# EasyEDA schematic board-rev1-schematic.json
TITLE: BE6502; REV: 3; Date: 2021-04-18; Sheet: 1/1; Drawn By: schlachet; Company: schlachet
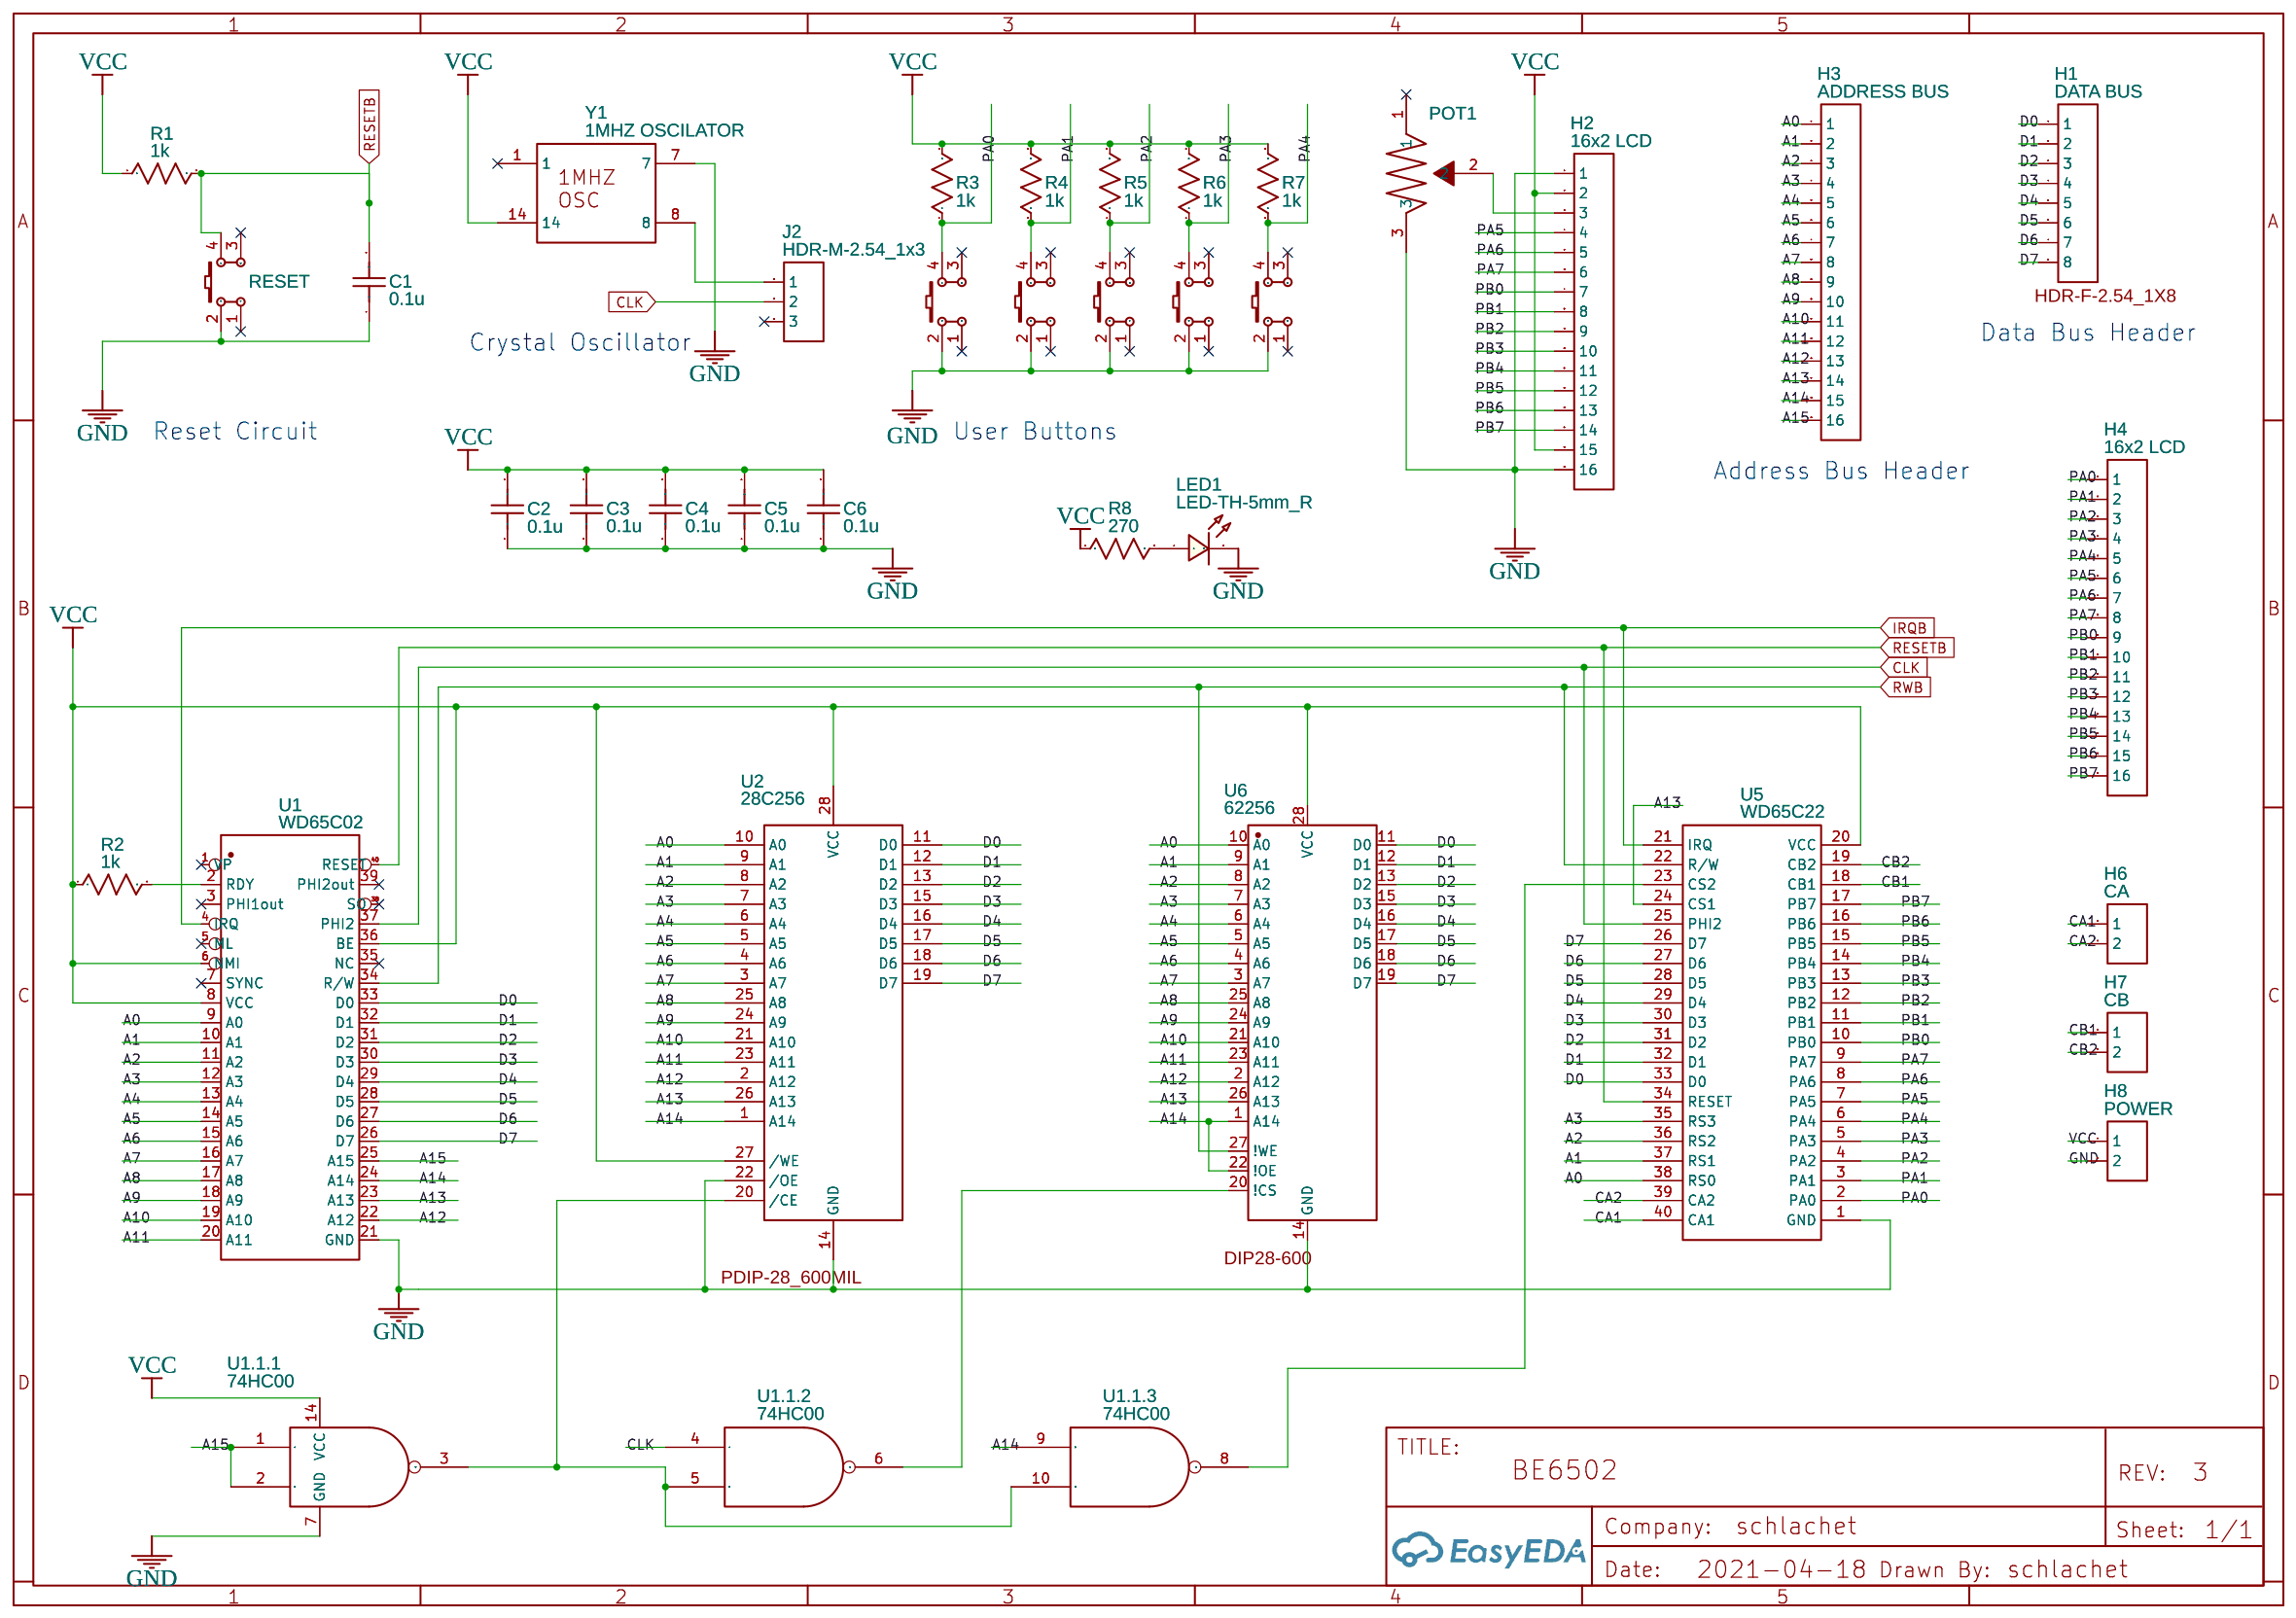
[diagram p0: schematic sheet]

## Parts
C1  0.1u  [RAD-0.1]
C2  0.1u  [RAD-0.1]
C3  0.1u  [RAD-0.1]
C4  0.1u  [RAD-0.1]
C5  0.1u  [RAD-0.1]
C6  0.1u  [RAD-0.1]
H1  DATA BUS  [HDR-F-2.54_1X8]
H2  16x2 LCD  [HDR-F-2.54_1X16]
H3  ADDRESS BUS  [HDR-F-2.54_1X16]
H4  16x2 LCD  [HDR-F-2.54_1X16]
H6  CA  [HDR-F-2.54_1X2]
H7  CB  [HDR-F-2.54_1X2]
H8  POWER  [HDR-F-2.54_1X2]
J2  HDR-M-2.54_1x3  [HDR-M-2.54_1X3]
KEY2  K4-6×6_TH  [KEY-TH_4P-L6.0-W6.0-P4.50-LS6.5]
KEY3  K4-6×6_TH  [KEY-TH_4P-L6.0-W6.0-P4.50-LS6.5]
KEY4  K4-6×6_TH  [KEY-TH_4P-L6.0-W6.0-P4.50-LS6.5]
KEY5  K4-6×6_TH  [KEY-TH_4P-L6.0-W6.0-P4.50-LS6.5]
KEY6  K4-6×6_TH  [KEY-TH_4P-L6.0-W6.0-P4.50-LS6.5]
LED1  LED-TH-5mm_R  [LED-TH_BD5.0_RED]
POT1  3352 - 3/8 ˝ Round Trimpot Trimming Potentiometer  [3352 - 3/8 ˝ ROUND TRIMPOT TRIMMING POTENTIOMETER]
R1  1k  [R_AXIAL-0.3]
R2  1k  [R_AXIAL-0.3]
R3  1k  [R_AXIAL-0.3]
R4  1k  [R_AXIAL-0.3]
R5  1k  [R_AXIAL-0.3]
R6  1k  [R_AXIAL-0.3]
R7  1k  [R_AXIAL-0.3]
R8  270  [R_AXIAL-0.3]
RESET  K4-6×6_TH  [KEY-TH_4P-L6.0-W6.0-P4.50-LS6.5]
U1  WD65C02  [DIP-40_L52.3-W13.9-P2.54-LS15.2-BL]
U1.1  74HC00  [DIP-14_L19.0-W7.0-P2.54-LS7.6-BL]  (sections 1,2,3)
U2  28C256  [PDIP-28_600MIL]
U5  WD65C22  [DIP-40_L52.0-W13.7-P2.54-LS15.2-BL]
U6  62256  [DIP28-600]
Y1  1MHZ OSCILATOR  [1 MHZ OSC]

## Library data of the parts
C1-C6 = C_RAD-0.1_US: Contributor: LCEDA_Lib
H1 = HDR-F-2.54_1x8: Supplier Part: C225505; Supplier: LCSC; Contributor: LCEDA_Lib; Package Display: Yes
H2-H4 = HDR-F-2.54_1x16: Supplier Part: C66987; Supplier: LCSC; Contributor: LCEDA_Lib
H6-H8 = HDR-F-2.54_1x2: Supplier Part: C49661; Supplier: LCSC; Contributor: LCEDA_Lib
J2 = HDR-M-2.54_1x3: Supplier Part: C180248; Supplier: LCSC; Contributor: LCEDA_Lib
KEY2-KEY6 RESET = K4-6×6_TH: Supplier: LCSC; Supplier Part: C136684; Manufacturer: 韩国韩荣; Manufacturer Part: K2-1102DP-E4SW-04; Contributor: LCEDA_Lib
LED1 = LED-TH-5mm_R: Manufacturer: EVERLIGHT(台湾亿光); Manufacturer Part: 333-2SURD/S530-A3; Supplier Part: C87271; Supplier: LCSC; Contributor: LCEDA_Lib
POT1 = 3352 - 3/8 ˝ Round Trimpot Trimming Potentiometer: Manufacturer: Bourns Inc.; Manufacturer Part: 3352T-1-103LF; Supplier: Digi-Key; Supplier Part: 3352T-103LF-ND; link: https://www.digikey.ca/en/products/detail/bourns-inc/3352T-1-103LF/1088341; Contributor: pilotstev
R1-R8 = R_AXIAL-0.3_US: Contributor: LCEDA_Lib
U1 = WD65C02: link: https://eater.net/datasheets/w65c02s.pdf; Contributor: BBMBB
U1.1 = 74HC00: Contributor: i.kamsai; subpart_no: 1
U2 = 28C256: Manufacturer: Catalyst Semiconductor; Manufacturer Part: CAT28C256; Contributor: marek999.1999; Package Display: Yes
U5 = WD65C22: Contributor: 21schemerhornn
U6 = 62256: Supplier: Digi-Key; Contributor: Havachi; Package Display: Yes
Y1 = 1MHZ OSCILATOR: Contributor: wpratt

## Nets
GND: C1.1 C2.1 C3.1 C4.1 C5.1 C6.1 H2.1 H2.16 H8.2 KEY2.2 KEY3.2 KEY4.2 KEY5.2 KEY6.2 LED1.2 POT1.3 RESET.2 U1.21(GND) U1.1.7(GND) U2.14(GND) U2.22(/OE) U5.1(GND) U6.14(GND) Y1.7
VCC: C2.2 C3.2 C4.2 C5.2 C6.2 H2.2 H2.15 H8.1 R1.1 R2.1 R3.2 R4.2 R5.2 R6.2 R7.2 R8.1 U1.6(NMI) U1.8(VCC) U1.36(BE) U1.1.14(VCC) U2.27(/WE) U2.28(VCC) U5.20(VCC) U6.28(VCC) Y1.14
A0: H3.1 U1.9(A0) U2.10(A0) U5.38(RS0) U6.10(A0)
A1: H3.2 U1.10(A1) U2.9(A1) U5.37(RS1) U6.9(A1)
A2: H3.3 U1.11(A2) U2.8(A2) U5.36(RS2) U6.8(A2)
A3: H3.4 U1.12(A3) U2.7(A3) U5.35(RS3) U6.7(A3)
A4: H3.5 U1.13(A4) U2.6(A4) U6.6(A4)
A5: H3.6 U1.14(A5) U2.5(A5) U6.5(A5)
A6: H3.7 U1.15(A6) U2.4(A6) U6.4(A6)
A7: H3.8 U1.16(A7) U2.3(A7) U6.3(A7)
A8: H3.9 U1.17(A8) U2.25(A8) U6.25(A8)
A9: H3.10 U1.18(A9) U2.24(A9) U6.24(A9)
A10: H3.11 U1.19(A10) U2.21(A10) U6.21(A10)
A11: H3.12 U1.20(A11) U2.23(A11) U6.23(A11)
A12: H3.13 U1.22(A12) U2.2(A12) U6.2(A12)
A13: H3.14 U1.23(A13) U2.26(A13) U5.24(CS1) U6.26(A13)
A14: H3.15 U1.24(A14) U1.1.9 U2.1(A14) U6.1(A14) U6.22(!OE)
A15: H3.16 U1.25(A15) U1.1.1 U1.1.2
CA1: H6.1 U5.40(CA1)
CA2: H6.2 U5.39(CA2)
CB1: H7.1 U5.18(CB1)
CB2: H7.2 U5.19(CB2)
CLK: J2.2 U1.37(PHI2) U1.1.4 U5.25(PHI2)
D0: H1.1 U1.33(D0) U2.11(D0) U5.33(D0) U6.11(D0)
D1: H1.2 U1.32(D1) U2.12(D1) U5.32(D1) U6.12(D1)
D2: H1.3 U1.31(D2) U2.13(D2) U5.31(D2) U6.13(D2)
D3: H1.4 U1.30(D3) U2.15(D3) U5.30(D3) U6.15(D3)
D4: H1.5 U1.29(D4) U2.16(D4) U5.29(D4) U6.16(D4)
D5: H1.6 U1.28(D5) U2.17(D5) U5.28(D5) U6.17(D5)
D6: H1.7 U1.27(D6) U2.18(D6) U5.27(D6) U6.18(D6)
D7: H1.8 U1.26(D7) U2.19(D7) U5.26(D7) U6.19(D7)
IRQB: U1.4(IRQ) U5.21(IRQ)
PA0: H4.1 KEY2.4 R3.1 U5.2(PA0)
PA1: H4.2 KEY3.4 R4.1 U5.3(PA1)
PA2: H4.3 KEY4.4 R5.1 U5.4(PA2)
PA3: H4.4 KEY5.4 R6.1 U5.5(PA3)
PA4: H4.5 KEY6.4 R7.1 U5.6(PA4)
PA5: H2.4 H4.6 U5.7(PA5)
PA6: H2.5 H4.7 U5.8(PA6)
PA7: H2.6 H4.8 U5.9(PA7)
PB0: H2.7 H4.9 U5.10(PB0)
PB1: H2.8 H4.10 U5.11(PB1)
PB2: H2.9 H4.11 U5.12(PB2)
PB3: H2.10 H4.12 U5.13(PB3)
PB4: H2.11 H4.13 U5.14(PB4)
PB5: H2.12 H4.14 U5.15(PB5)
PB6: H2.13 H4.15 U5.16(PB6)
PB7: H2.14 H4.16 U5.17(PB7)
RESETB: C1.2 R1.2 RESET.4 U1.40(RESET) U5.34(RESET)
RWB: U1.34(R/W) U5.22(R/W) U6.27(!WE)
Net-(H2-3): H2.3 POT1.2
Net-(J2-1): J2.1 Y1.8
Net-(LED1-1): LED1.1 R8.2
Net-(R2-2): R2.2 U1.2(RDY)
Net-(U1.1.1-3): U1.1.3 U1.1.5 U1.1.10 U2.20(/CE)
Net-(U1.1.2-6): U1.1.6 U6.20(!CS)
Net-(U1.1.3-8): U1.1.8 U5.23(CS2)

Not connected (* = marked no-connect by the designer): J2 3*; KEY2 1* 3*; KEY3 1* 3*; KEY4 1* 3*; KEY5 1* 3*; KEY6 1* 3*; POT1 1*; RESET 1* 3*; U1 1(VP)* 3(PHI1out)* 5(ML)* 7(SYNC)* 35(NC)* 38(SO)* 39(PHI2out)*; Y1 1*

## Notes on the sheet
- Data Bus Header
- Crystal Oscillator
- Reset Circuit
- User Buttons
- Address Bus Header
